# EAGLE design integrated_v2 (EAGLE 9.6.2)
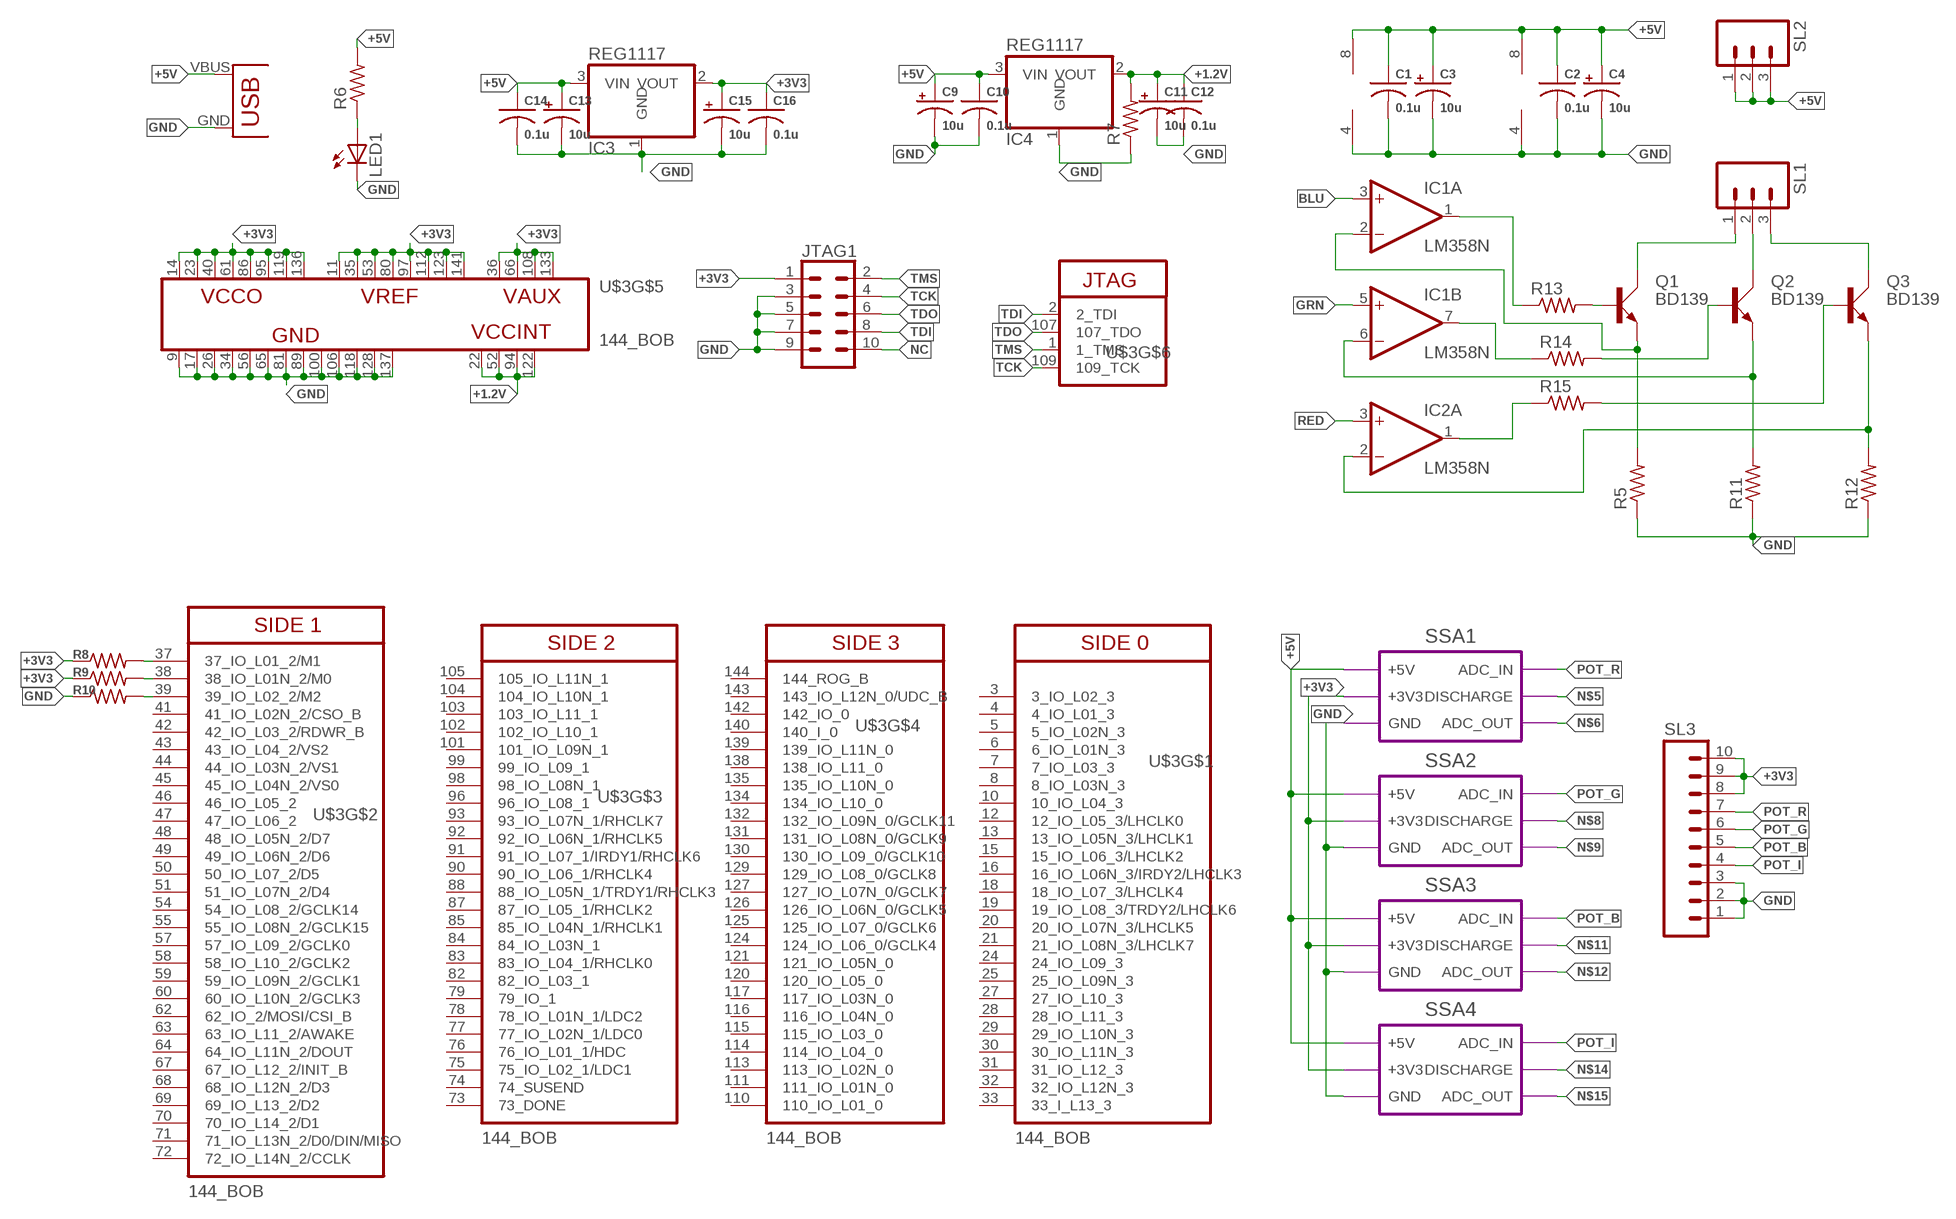
[diagram p0: schematic, sheet 1]

## Parts
C1  0.1u  CAP0603  [C0603]
C2  0.1u  CAP0603  [C0603]
C3  10u  CAP_POL_16V  [B/3528-21R]
C4  10u  CAP_POL_16V  [B/3528-21R]
C9  10u  CAP_POL_16V  [B/3528-21R]
C10  0.1u  CAP0603  [C0603]
C11  10u  CAP_POL_16V  [B/3528-21R]
C12  0.1u  CAP0603  [C0603]
C13  10u  CAP_POL_16V  [B/3528-21R]
C14  0.1u  CAP0603  [C0603]
C15  10u  CAP_POL_16V  [B/3528-21R]
C16  0.1u  CAP0603  [C0603]
IC1  LM358N  [DIL08]
IC2  LM358N  [DIL08]
IC3  REG1117  [SOT223]
IC4  REG1117  [SOT223]
JTAG1  CONN_05X2  [2X5-SHROUDED_LOCK_PROPER]
LED1  LED3MM  [LED3MM]
Q1  BD139  [TO126AV]
Q2  BD139  [TO126AV]
Q3  BD139  [TO126AV]
R5  4.7  R-US_0411/15  [0411/15]
R6  R-US_0204/7  [0204/7]
R7  R-US_0204/7  [0204/7]
R8  RESISTOR0805  [R0805]
R9  RESISTOR0805  [R0805]
R10  RESISTOR0805  [R0805]
R11  R-US_0411/15  [0411/15]
R12  R-US_0411/15  [0411/15]
R13  R-US_0204/7  [0204/7]
R14  R-US_0204/7  [0204/7]
R15  R-US_0204/7  [0204/7]
SL1  M03  [03P]
SL2  M03  [03P]
SL3  M10  [10P]
U$3  144_BOB  [144_BOB]
U$4  USB(POWER)  [USB(POWER)]

## Module instances
SSA1 = SINGLESLOPEADC
SSA2 = SINGLESLOPEADC
SSA3 = SINGLESLOPEADC
SSA4 = SINGLESLOPEADC

## Nets
+1.2V: C11.+ C12.1 IC4.2(VOUT) R7.2 U$3.22(22_VCCINT) U$3.52(52_VCCINT) U$3.94(94_VCCINT) U$3.122(122_VCCINT)
+3V3: C15.+ C16.1 IC3.2(VOUT) JTAG1.1 R8.1 R9.1 SL3.8 SL3.9 SL3.10 U$3.11(11_VREF) U$3.14(14_VCCO) U$3.23(23_VCCO) U$3.35(35_VREF) U$3.36(36_VAUX) U$3.40(40_VCCO) U$3.53(53_VREF) U$3.61(61_VCCO) U$3.66(66_VAUX) U$3.80(80_VREF) U$3.86(86_VCCO) U$3.95(95_VCCO) U$3.97(97_VREF) U$3.108(108_VAUX) U$3.112(112_VREF) U$3.119(119_VCCO) U$3.123(123_VREF) U$3.133(133_VAUX) U$3.136(136_VCCO) U$3.141(141_VREF) ; port SSA1.+3V3 SSA2.+3V3 SSA3.+3V3 SSA4.+3V3
+5V: C1.1 C2.1 C3.+ C4.+ C9.+ C10.1 C13.+ C14.1 IC1.8(P:V+) IC2.8(P:V+) IC3.3(VIN) IC4.3(VIN) R6.2 SL2.1 SL2.2 SL2.3 U$4.VBUS(VCC) ; port SSA1.+5V SSA2.+5V SSA3.+5V SSA4.+5V
BLU: IC1.3(A:+IN)
GND: C1.2 C2.2 C3.- C4.- C9.- C10.2 C11.- C12.2 C13.- C14.2 C15.- C16.2 IC1.4(P:V-) IC2.4(P:V-) IC3.1(GND) IC4.1(GND) JTAG1.3 JTAG1.5 JTAG1.7 JTAG1.9 LED1.K(C) R5.1 R7.1 R10.1 R11.1 R12.1 SL3.1 SL3.2 SL3.3 U$3.9(9_GND) U$3.17(17_GND) U$3.26(26_GND) U$3.34(34_GND) U$3.56(56_GND) U$3.65(65_GND) U$3.81(81_GND) U$3.89(89_GND) U$3.100(100_GND) U$3.106(106_GND) U$3.118(118_GND) U$3.128(128_GND) U$3.137(137_GND) U$4.GND ; port SSA1.GND SSA3.GND SSA4.GND SSA2.GND
GRN: IC1.5(B:+IN)
N$1: Q1.C SL1.1
N$2: Q3.C SL1.3
N$3: Q2.C SL1.2
N$5: port SSA1.DISCHARGE
N$6: port SSA1.ADC_OUT
N$8: port SSA2.DISCHARGE
N$9: port SSA2.ADC_OUT
N$11: port SSA3.DISCHARGE
N$12: port SSA3.ADC_OUT
N$14: port SSA4.DISCHARGE
N$15: port SSA4.ADC_OUT
N$16: Q1.B R13.2
N$17: Q2.B R14.2
N$18: Q3.B R15.2
N$19: IC1.6(B:-IN) Q2.E R11.2
N$20: IC1.1(A:OUT) R13.1
N$21: IC1.7(B:OUT) R14.1
N$22: IC2.1(A:OUT) R15.1
N$23: IC1.2(A:-IN) Q1.E R5.2
N$24: LED1.A R6.1
N$25: R8.2 U$3.37(37_IO_L01_2/M1)
N$26: R9.2 U$3.38(38_IO_L01N_2/M0)
N$27: R10.2 U$3.39(39_IO_L02_2/M2)
N$32: IC2.2(A:-IN) Q3.E R12.2
NC: JTAG1.10
POT_B: SL3.5 ; port SSA3.ADC_IN
POT_G: SL3.6 ; port SSA2.ADC_IN
POT_I: SL3.4 ; port SSA4.ADC_IN
POT_R: SL3.7 ; port SSA1.ADC_IN
RED: IC2.3(A:+IN)
TCK: JTAG1.4 U$3.109(109_TCK)
TDI: JTAG1.8 U$3.2(2_TDI)
TDO: JTAG1.6 U$3.107(107_TDO)
TMS: JTAG1.2 U$3.1(1_TMS)
Unconnected: IC2.5(B:+IN) IC2.6(B:-IN) IC2.7(B:OUT) U$3.3(3_IO_L02_3) U$3.4(4_IO_L01_3) U$3.5(5_IO_L02N_3) U$3.6(6_IO_L01N_3) U$3.7(7_IO_L03_3) U$3.8(8_IO_L03N_3) U$3.10(10_IO_L04_3) U$3.12(12_IO_L05_3/LHCLK0) U$3.13(13_IO_L05N_3/LHCLK1) U$3.15(15_IO_L06_3/LHCLK2) U$3.16(16_IO_L06N_3/IRDY2/LHCLK3) U$3.18(18_IO_L07_3/LHCLK4) U$3.19(19_IO_L08_3/TRDY2/LHCLK6) U$3.20(20_IO_L07N_3/LHCLK5) U$3.21(21_IO_L08N_3/LHCLK7) U$3.24(24_IO_L09_3) U$3.25(25_IO_L09N_3) U$3.27(27_IO_L10_3) U$3.28(28_IO_L11_3) U$3.29(29_IO_L10N_3) U$3.30(30_IO_L11N_3) U$3.31(31_IO_L12_3) U$3.32(32_IO_L12N_3) U$3.33(33_I_L13_3) U$3.41(41_IO_L02N_2/CSO_B) U$3.42(42_IO_L03_2/RDWR_B) U$3.43(43_IO_L04_2/VS2) U$3.44(44_IO_L03N_2/VS1) U$3.45(45_IO_L04N_2/VS0) U$3.46(46_IO_L05_2) U$3.47(47_IO_L06_2) U$3.48(48_IO_L05N_2/D7) U$3.49(49_IO_L06N_2/D6) U$3.50(50_IO_L07_2/D5) U$3.51(51_IO_L07N_2/D4) U$3.54(54_IO_L08_2/GCLK14) U$3.55(55_IO_L08N_2/GCLK15) U$3.57(57_IO_L09_2/GCLK0) U$3.58(58_IO_L10_2/GCLK2) U$3.59(59_IO_L09N_2/GCLK1) U$3.60(60_IO_L10N_2/GCLK3) U$3.62(62_IO_2/MOSI/CSI_B) U$3.63(63_IO_L11_2/AWAKE) U$3.64(64_IO_L11N_2/DOUT) U$3.67(67_IO_L12_2/INIT_B) U$3.68(68_IO_L12N_2/D3) U$3.69(69_IO_L13_2/D2) U$3.70(70_IO_L14_2/D1) U$3.71(71_IO_L13N_2/D0/DIN/MISO) U$3.72(72_IO_L14N_2/CCLK) U$3.73(73_DONE) U$3.74(74_SUSEND) U$3.75(75_IO_L02_1/LDC1) U$3.76(76_IO_L01_1/HDC) U$3.77(77_IO_L02N_1/LDC0) U$3.78(78_IO_L01N_1/LDC2) U$3.79(79_IO_1) U$3.82(82_IO_L03_1) U$3.83(83_IO_L04_1/RHCLK0) U$3.84(84_IO_L03N_1) U$3.85(85_IO_L04N_1/RHCLK1) U$3.87(87_IO_L05_1/RHCLK2) U$3.88(88_IO_L05N_1/TRDY1/RHCLK3) U$3.90(90_IO_L06_1/RHCLK4) U$3.91(91_IO_L07_1/IRDY1/RHCLK6) U$3.92(92_IO_L06N_1/RHCLK5) U$3.93(93_IO_L07N_1/RHCLK7) U$3.96(96_IO_L08_1) U$3.98(98_IO_L08N_1) U$3.99(99_IO_L09_1) U$3.101(101_IO_L09N_1) U$3.102(102_IO_L10_1) U$3.103(103_IO_L11_1) U$3.104(104_IO_L10N_1) U$3.105(105_IO_L11N_1) U$3.110(110_IO_L01_0) U$3.111(111_IO_L01N_0) U$3.113(113_IO_L02N_0) U$3.114(114_IO_L04_0) U$3.115(115_IO_L03_0) U$3.116(116_IO_L04N_0) U$3.117(117_IO_L03N_0) U$3.120(120_IO_L05_0) U$3.121(121_IO_L05N_0) U$3.124(124_IO_L06_0/GCLK4) U$3.125(125_IO_L07_0/GCLK6) U$3.126(126_IO_L06N_0/GCLK5) U$3.127(127_IO_L07N_0/GCLK7) U$3.129(129_IO_L08_0/GCLK8) U$3.130(130_IO_L09_0/GCLK10) U$3.131(131_IO_L08N_0/GCLK9) U$3.132(132_IO_L09N_0/GCLK11) U$3.134(134_IO_L10_0) U$3.135(135_IO_L10N_0) U$3.138(138_IO_L11_0) U$3.139(139_IO_L11N_0) U$3.140(140_I_0) U$3.142(142_IO_0) U$3.143(143_IO_L12N_0/UDC_B) U$3.144(144_ROG_B)

## Library data of the parts
C1 C2 C10 C12 C14 C16 = CEDT_JANUARY_2015_v5:CAP
C3 C4 C9 C11 C13 C15 = CEDT_JANUARY_2015_v5:CAP_POL
IC1 IC2 = CEDT_JANUARY_2015:LM358: OP AMP also LM158; LM258; LM2904 Source: http://cache.national.com/ds/LM/LM158.pdf
IC3 IC4 = CEDT_JANUARY_2015_v5:REG1117: 800mA and 1A Low Dropout (LDO) Positive Regulator 1.8V, 2.5V, 2.85V, 3.3V, 5V, and Adj
JTAG1 = SparkFun-Connectors_v3:CONN_05X2: Multi connection point. Often used as Generic Header-pin footprint for 0.1 inch spaced/style header connections For AVR SPI programming port, see special device with nice symbol: "AVR_SPI_PROG_5x2.dev" You can populate with any combo of single row headers, but if you'd like an exact match, check these: 2x5 AVR ICSP Male Header <https://www.sparkfun.com/products/778> (PRT-00778) 2x5 Pin Shrouded Header <https://www.sparkfun.com/products/8506> (PRT-08506) On any of the 0.1 inch spaced packages, you can populate with these: Break Away Headers - Straight <https://www.sparkfun.com/products/116> (PRT-00116) Break Away Male Headers - Right Angle <https://www.sparkfun.com/products/553> (PRT-00553) Female Headers <https://www.sparkfun.com/products/115> (PRT-00115) Break Away Headers - Machine Pin <https://www.sparkfun.com/products/117> (PRT-00117) Break Away Female Headers - Swiss Machine Pin <https://www.sparkfun.com/products/743> (PRT-00743) Special note: the shrouded connector mates well with our 5x2 ribbon cables: 2x5 Pin IDC Ribbon Cable <https://www.sparkfun.com/products/8535> (PRT-08535)
LED1 = CEDT_JANUARY_2015_v5:LED
Q1-Q3 = transistor-power:BD139: NPN TRANSISTOR
R5 R11-R15 = resistor:R-US_: RESISTOR, American symbol
R6 R7 = rcl:R-US_: RESISTOR, American symbol; SPICEPREFIX: R
R8-R10 = CEDT_JANUARY_2015_v5:RESISTOR
SL1 SL2 = con-amp-quick:M03: AMP QUICK CONNECTOR; OC_FARNELL: unknown; OC_NEWARK: unknown
SL3 = con-amp-quick:M10: AMP QUICK CONNECTOR; OC_FARNELL: unknown; OC_NEWARK: unknown
U$3 = Suprio_Lib:144_BOB
U$4 = CEDT_JANUARY_2015_v5:USB(POWER)

## Module SINGLESLOPEADC
Ports: +5V(pwr) +3V3(pwr) GND(pwr) ADC_IN(in) DISCHARGE(in) ADC_OUT(out)
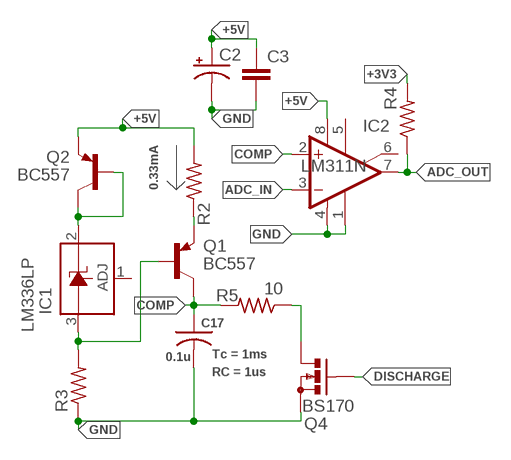
[diagram p1: schematic, module SINGLESLOPEADC, sheet 1]

### Parts
C2  CPOL-USE2.5-5  [E2,5-5]
C3  C-EU025-024X044  [C025-024X044]
C17  0.1u  CAP0603  [C0603]
IC1  LM336LP  [TO92]
IC2  LM311N  [DIL08]
Q1  BC557  PNP_BC557*TO92  [TO92]
Q2  BC557  PNP_BC557*TO92  [TO92]
Q4  BS170  [SOT54E]
R2  R-US_0204/7  [0204/7]
R3  R-US_0204/7  [0204/7]
R4  R-US_0204/7  [0204/7]
R5  10  RESISTOR0207/7  [0207/7]

### Nets
+3V3: R4.2
+5V: C2.+ C3.1 IC2.8(V+) Q2.3(E) R2.2
ADC_IN: IC2.3(-IN)
ADC_OUT: IC2.7(OUT) R4.1
COMP: C17.1 IC2.2(+IN) Q1.1(C) R5.2
DISCHARGE: Q4.G
GND: C2.- C3.2 C17.2 IC2.1(GND) IC2.4(V-) Q4.S R3.1
N$2: Q1.3(E) R2.1
N$3: IC1.2(C) Q2.1(C) Q2.2(B)
N$4: IC1.3(A) Q1.2(B) R3.2
N$5: Q4.D R5.1
Unconnected: IC1.1(ADJ) IC2.5(ON) IC2.6(ON/STR)

### Notes on the sheet
- 0.33mA
- Tc = 1ms
- RC = 1us

### Library data of the parts
C2 = rcl:CPOL-US: POLARIZED CAPACITOR, American symbol; SPICEPREFIX: C
C3 = rcl:C-EU: CAPACITOR, European symbol; SPICEPREFIX: C
C17 = CEDT_JANUARY_2015_v5:CAP
IC1 = linear:LM336: 2.5-V INTEGRATED REFERENCE CIRCUITS LM236 Source: http://focus.ti.com/lit/ds/symlink/lm336-2.5.pdf
IC2 = linear:LM311: COMPARATOR
Q1 Q2 = Transistor:PNP_: PNP - Popular parts; CATEGORY: Transistor; SUB-CATEGORY: BJT; TYPE: PNP
Q4 = transistor-small-signal:BS170: N-CHANNEL MOS FET
R2-R4 = rcl:R-US_: RESISTOR, American symbol; SPICEPREFIX: R
R5 = CEDT_JANUARY_2015_v5 (1):RESISTOR

## Net classes
0 default: width 0.406 mm

## Board
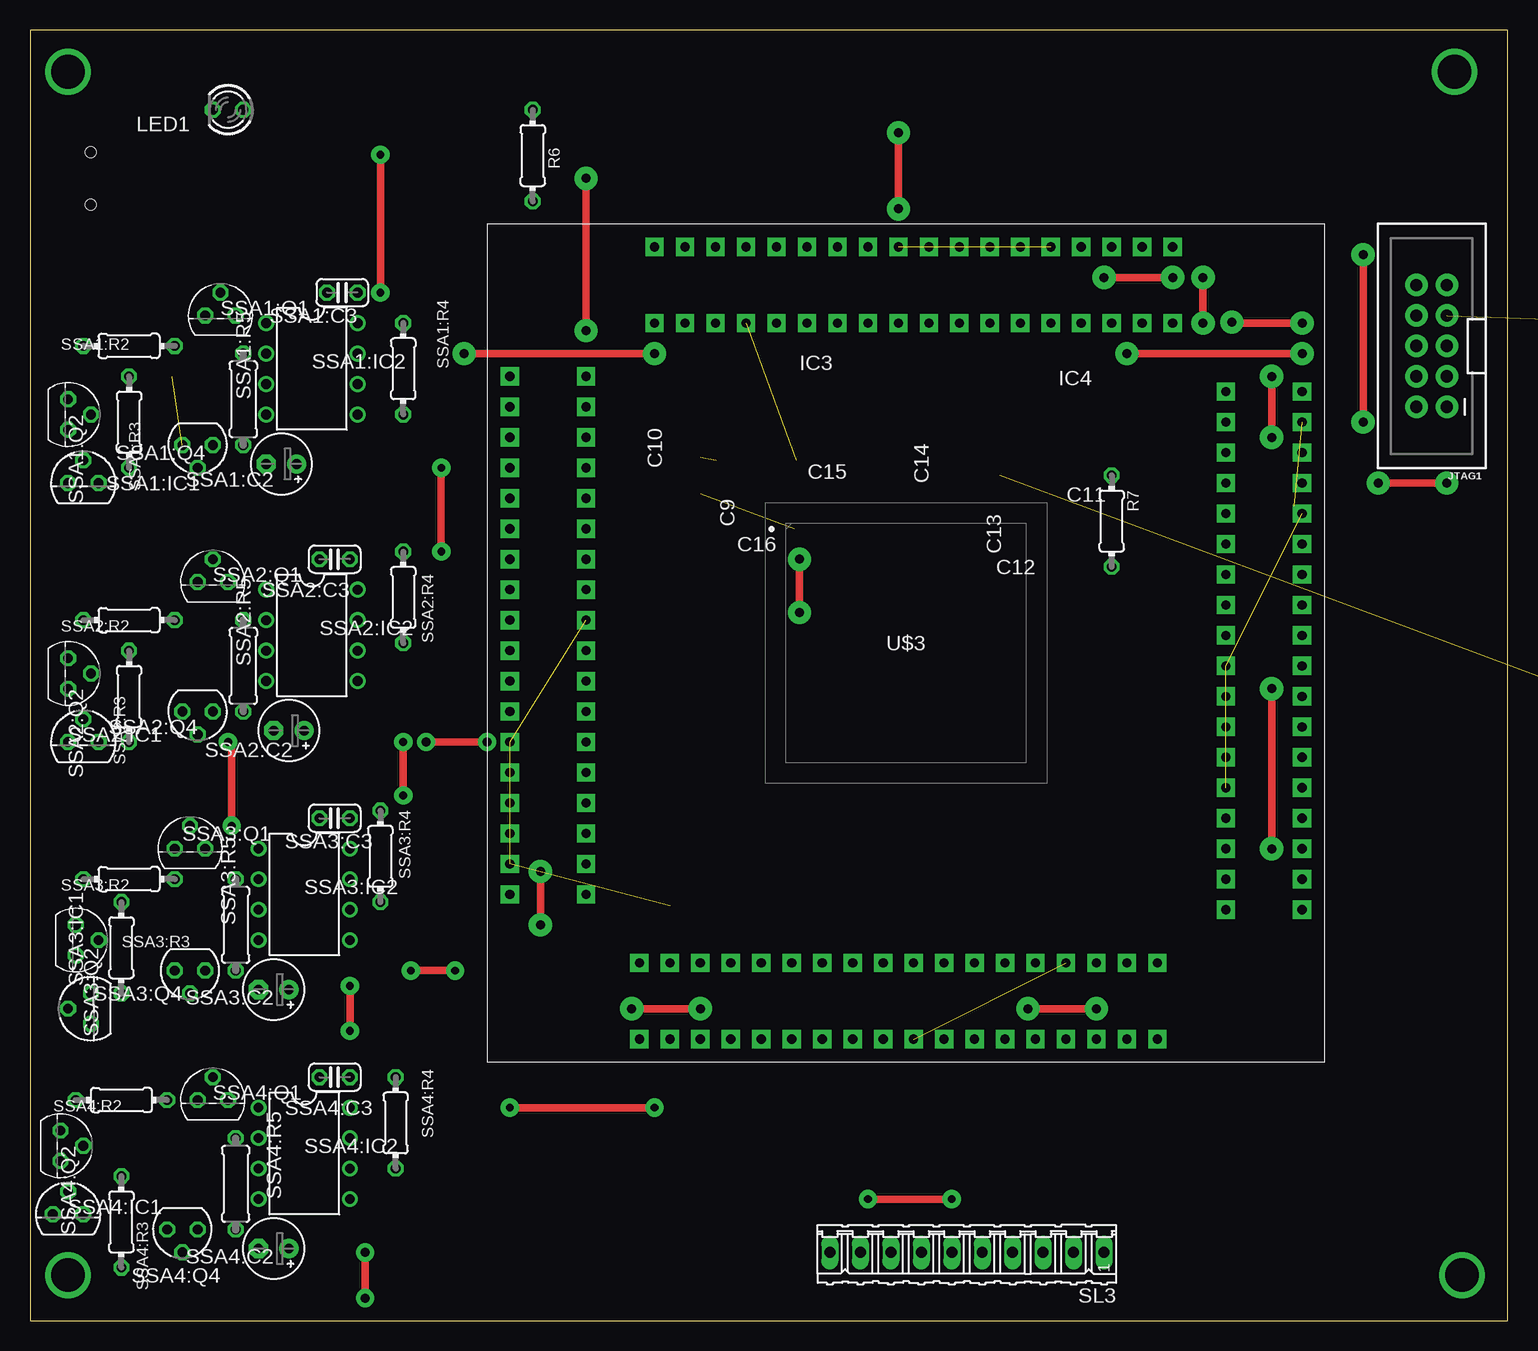
[diagram p2: board, top side]
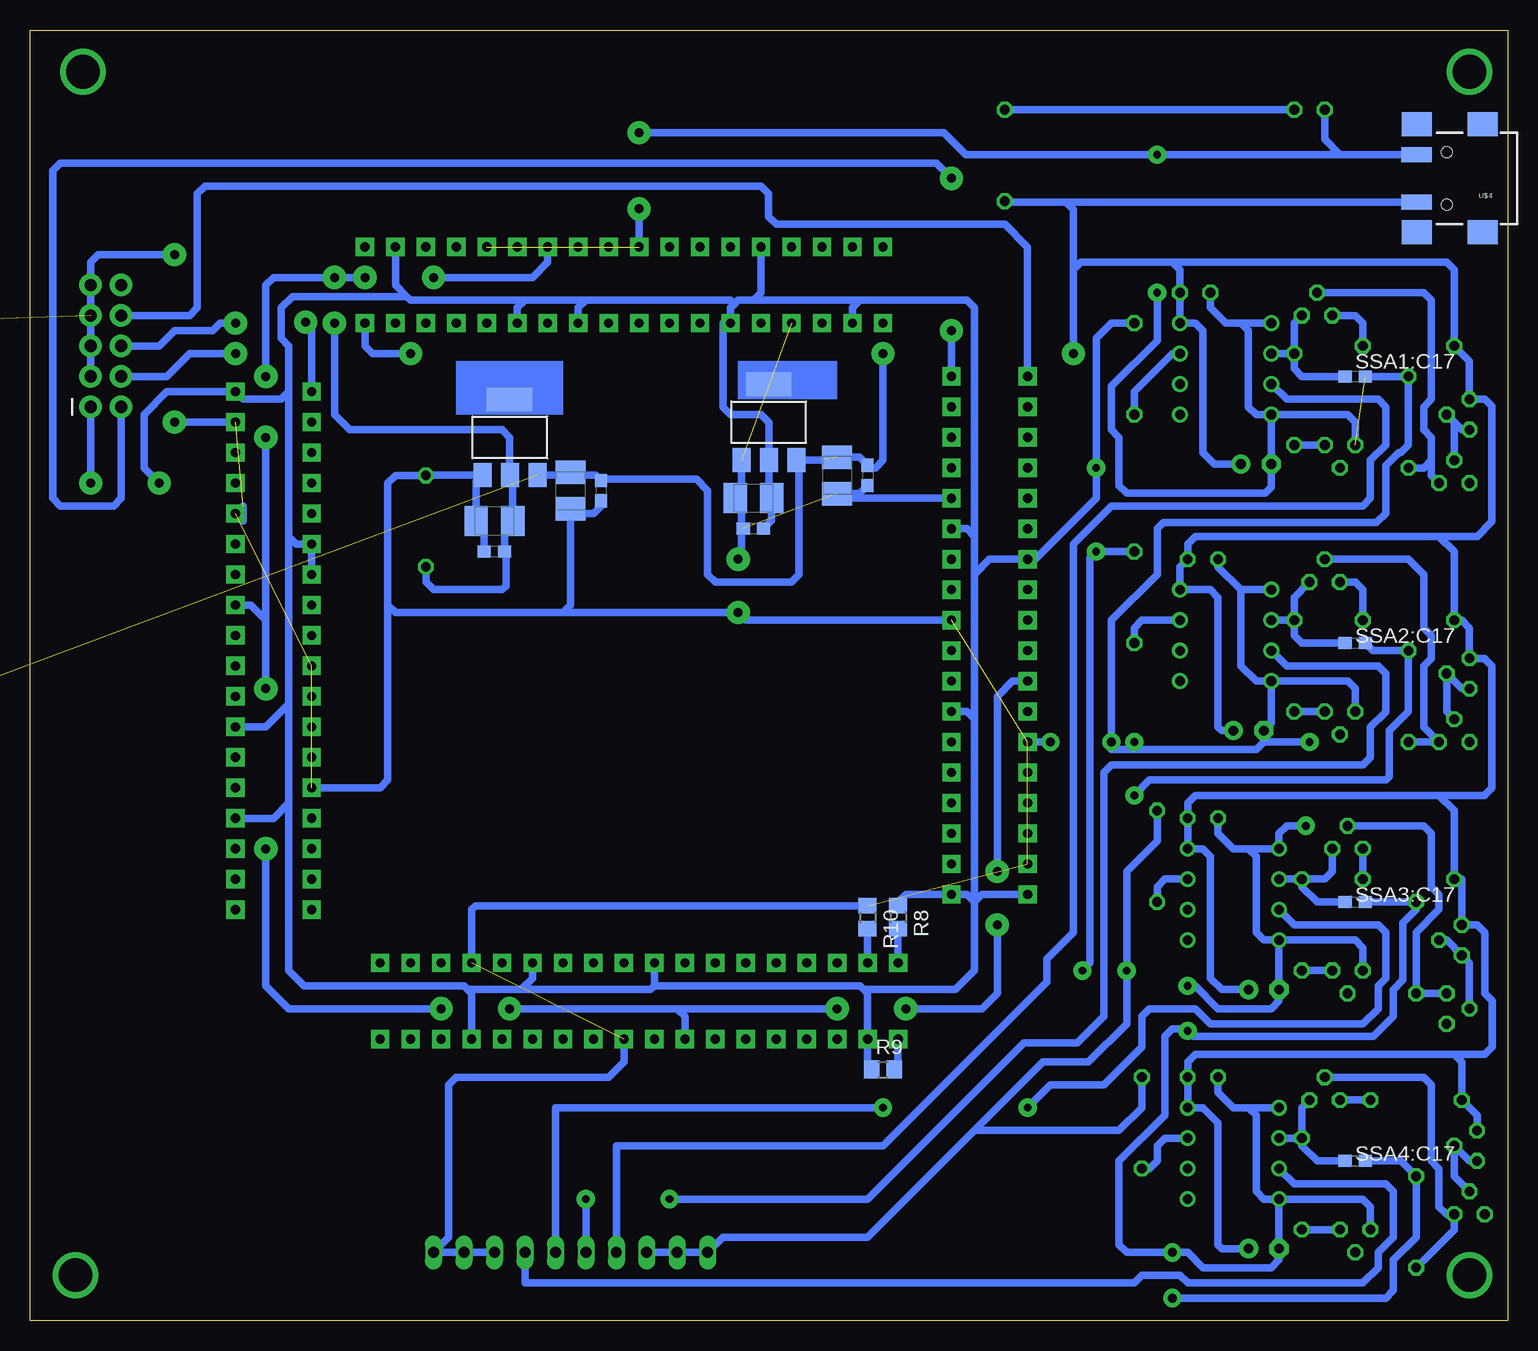
[diagram p3: board, bottom side, seen from below]

Size 123.17 x 107.62 mm. Coordinates in mm from the lower left corner, seen from the top.
Outline: 0,0 123.17,0 123.17,107.62 0,107.62 0,0
Copper layers (1*16): Top 0.035mm / dielectric 1.5mm / Bottom 0.035mm
Design rules "default *": minimum track width 6mil, minimum drill 0.35mm, track to track 16mil, track to pad 16mil, pad to pad 16mil, via to via 16mil, smd to smd 16mil, copper to edge 40mil, drill to drill 6mil, minimum pad ring 10mil, minimum via ring 8mil, stop-mask expansion 4mil, vias tented up to drill 0mil, thermal gap 10mil

### Footprints (pad centres in the part's own frame; a part is rotated, then mirrored left to right if it is on the bottom)
C0603 = smd 1.1 x 1: 1 -0.85,0; 2 0.85,0
B/3528-21R = smd 1.95 x 2.5: + 1.525,0; - -1.525,0
DIL08 = drill 0.813 long: 1 -3.81,-3.81; 2 -1.27,-3.81; 3 1.27,-3.81; 4 3.81,-3.81; 5 3.81,3.81; 6 1.27,3.81; 7 -1.27,3.81; 8 -3.81,3.81
SOT223 = smd 1.499 x 2.007: 1 -2.261,-3.15; 2 0.025,-3.15; 3 2.311,-3.15 | smd 3.81 x 2.007: 4 0,3.15
2X5-SHROUDED_LOCK_PROPER = drill 1.016 pad 1.88: 1 -1.27,5.08; 2 1.27,5.08; 3 -1.27,2.54; 4 1.27,2.54; 5 -1.27,0; 6 1.27,0; 7 -1.27,-2.54; 8 1.27,-2.54; 9 -1.27,-5.08; 10 1.27,-5.08
LED3MM = drill 0.813 octagon: A -1.27,0; K 1.27,0
TO126AV = drill 1.016 long: B 2.286,-1.27; C 0,-1.27; E -2.286,-1.27
0411/15 = drill 0.914 octagon: 1 -7.62,0; 2 7.62,0
0204/7 = drill 0.813 octagon: 1 -3.81,0; 2 3.81,0
R0805 = smd 1.3 x 1.5: 1 -0.95,0; 2 0.95,0
03P = drill 0.914 long: 1 -2.54,0; 2 0,0; 3 2.54,0
10P = drill 0.914 long: 1 -11.43,0; 2 -8.89,0; 3 -6.35,0; 4 -3.81,0; 5 -1.27,0; 6 1.27,0; 7 3.81,0; 8 6.35,0; 9 8.89,0; 10 11.43,0
E2,5-5 = drill 0.813 pad 1.6: + -1.27,0 | drill 0.813 pad 1.6 octagon: - 1.27,0
C025-024X044 = drill 0.813 octagon: 1 -1.27,0; 2 1.27,0
TO92 = drill 0.813 octagon: 1 -1.27,0; 2 0,1.905; 3 1.27,0
DIL08' = drill 0.813 pad 1.27: 1 -3.81,-3.81; 2 -1.27,-3.81; 3 1.27,-3.81; 4 3.81,-3.81; 5 3.81,3.81; 6 1.27,3.81; 7 -1.27,3.81; 8 -3.81,3.81
TO92' = drill 0.813 octagon: 1 1.27,0; 2 0,1.905; 3 -1.27,0
SOT54E = drill 0.813 octagon: D -1.27,0; G 0,1.905; S 1.27,0
0207/7 = drill 0.813 octagon: 1 -3.81,0; 2 3.81,0
144_BOB = drill 0.762 pad 1.524 square: 1 -26.67,21.59; 2 -33.02,21.59; 3 -26.67,19.05; 4 -33.02,19.05; 5 -26.67,16.51; 6 -33.02,16.51; 7 -26.67,13.97; 8 -33.02,13.97; 9 -26.67,11.43; 10 -33.02,11.43; 11 -26.67,8.89; 12 -33.02,8.89; 13 -26.67,6.35; 14 -33.02,6.35; 15 -26.67,3.81; 16 -33.02,3.81; 17 -26.67,1.27; 18 -33.02,1.27; 19 -26.67,-1.27; 20 -33.02,-1.27; 21 -26.67,-3.81; 22 -33.02,-3.81; 23 -26.67,-6.35; 24 -33.02,-6.35; 25 -26.67,-8.89; 26 -33.02,-8.89; 27 -26.67,-11.43; 28 -33.02,-11.43; 29 -26.67,-13.97; 30 -33.02,-13.97; 31 -26.67,-16.51; 32 -33.02,-16.51; 33 -26.67,-19.05; 34 -33.02,-19.05; 35 -26.67,-21.59; 36 -33.02,-21.59; 37 -22.225,-27.305; 38 -22.225,-33.655; 39 -19.685,-27.305; 40 -19.685,-33.655; 41 -17.145,-27.305; 42 -17.145,-33.655; 43 -14.605,-27.305; 44 -14.605,-33.655; 45 -12.065,-27.305; 46 -12.065,-33.655; 47 -9.525,-27.305; 48 -9.525,-33.655; 49 -6.985,-27.305; 50 -6.985,-33.655; 51 -4.445,-27.305; 52 -4.445,-33.655; 53 -1.905,-27.305; 54 -1.905,-33.655; 55 0.635,-27.305; 56 0.635,-33.655; 57 3.175,-27.305; 58 3.175,-33.655; 59 5.715,-27.305; 60 5.715,-33.655; 61 8.255,-27.305; 62 8.255,-33.655; 63 10.795,-27.305; 64 10.795,-33.655; 65 13.335,-27.305; 66 13.335,-33.655; 67 15.875,-27.305; 68 15.875,-33.655; 69 18.415,-27.305; 70 18.415,-33.655; 71 20.955,-27.305; 72 20.955,-33.655; 73 26.67,-22.86; 74 33.02,-22.86; 75 26.67,-20.32; 76 33.02,-20.32; 77 26.67,-17.78; 78 33.02,-17.78; 79 26.67,-15.24; 80 33.02,-15.24; 81 26.67,-12.7; 82 33.02,-12.7; 83 26.67,-10.16; 84 33.02,-10.16; 85 26.67,-7.62; 86 33.02,-7.62; 87 26.67,-5.08; 88 33.02,-5.08; 89 26.67,-2.54; 90 33.02,-2.54; 91 26.67,0; 92 33.02,0; 93 26.67,2.54; 94 33.02,2.54; 95 26.67,5.08; 96 33.02,5.08; 97 26.67,7.62; 98 33.02,7.62; 99 26.67,10.16; 100 33.02,10.16; 101 26.67,12.7; 102 33.02,12.7; 103 26.67,15.24; 104 33.02,15.24; 105 26.67,17.78; 106 33.02,17.78; 107 26.67,20.32; 108 33.02,20.32; 109 22.225,26.035; 110 22.225,32.385; 111 19.685,26.035; 112 19.685,32.385; 113 17.145,26.035; 114 17.145,32.385; 115 14.605,26.035; 116 14.605,32.385; 117 12.065,26.035; 118 12.065,32.385; 119 9.525,26.035; 120 9.525,32.385; 121 6.985,26.035; 122 6.985,32.385; 123 4.445,26.035; 124 4.445,32.385; 125 1.905,26.035; 126 1.905,32.385; 127 -0.635,26.035; 128 -0.635,32.385; 129 -3.175,26.035; 130 -3.175,32.385; 131 -5.715,26.035; 132 -5.715,32.385; 133 -8.255,26.035; 134 -8.255,32.385; 135 -10.795,26.035; 136 -10.795,32.385; 137 -13.335,26.035; 138 -13.335,32.385; 139 -15.875,26.035; 140 -15.875,32.385; 141 -18.415,26.035; 142 -18.415,32.385; 143 -20.955,26.035; 144 -20.955,32.385
USB(POWER) = smd 2.54 x 1.27: GND 2.5,-1.981; VBUS 2.5,1.981 | smd 2.5 x 2: GND@1 -3,-4.5; GND@2 -3,4.5; GND@3 2.5,4.5; GND@4 2.5,-4.5 | hole 0.9: 0,2.2; 0,-2.2

### Placement (x,y rotation side)
C1  158.75,51.44 0 bottom  (outside the outline)
C2  158.75,46.35 0 bottom  (outside the outline)
C3  159.38,40.01 0 bottom  (outside the outline)
C4  159.38,33.02 0 bottom  (outside the outline)
C9  55.88,70.48 90 bottom
C10  53.34,70.48 270 bottom
C11  84.45,66.67 0 bottom
C12  84.45,64.14 180 bottom
C13  78.11,69.22 90 bottom
C14  75.56,69.22 270 bottom
C15  62.87,68.58 0 bottom
C16  62.87,66.04 180 bottom
IC1  142.88,100.97 0 top  (outside the outline)
IC2  155.57,100.97 0 top  (outside the outline)
IC3  61.59,74.93 0 bottom
IC4  83.19,73.66 0 bottom
JTAG1  116.84,81.28 180 top
LED1  16.51,100.97 180 top
Q1  140.34,94.61 0 top  (outside the outline)
Q2  149.22,94.61 0 top  (outside the outline)
Q3  158.12,94.61 0 top  (outside the outline)
R5  144.15,83.19 0 top  (outside the outline)
R6  41.91,97.16 270 top
R7  90.17,66.67 270 top
R8  50.8,33.66 270 bottom
R9  52.07,20.95 0 bottom
R10  53.34,33.66 270 bottom
R11  144.15,76.83 0 top  (outside the outline)
R12  144.15,70.48 0 top  (outside the outline)
R13  157.48,71.75 0 top  (outside the outline)
R14  140.34,65.41 0 top  (outside the outline)
R15  149.86,65.41 0 top  (outside the outline)
SL1  147.96,49.53 0 top  (outside the outline)
SL2  139.7,49.53 0 top  (outside the outline)
SL3  78.11,5.71 180 top
SSA1:C2  [E2,5-5]  20.95,71.44 180 top
SSA1:C3  [C025-024X044]  26.04,85.72 180 top
SSA1:C17  0.1u  [C0603]  12.7,78.74 0 bottom
SSA1:IC1  LM336LP  [TO92]  4.45,69.85 0 top
SSA1:IC2  LM311N  [DIL08']  23.5,79.38 270 top
SSA1:Q1  BC557  [TO92']  15.88,83.82 0 top
SSA1:Q2  BC557  [TO92']  3.17,75.56 270 top
SSA1:Q4  BS170  [SOT54E]  13.97,73.03 180 top
SSA1:R2  [0204/7]  8.26,81.28 180 top
SSA1:R3  [0204/7]  8.26,74.93 270 top
SSA1:R4  [0204/7]  31.11,79.38 90 top
SSA1:R5  10  [0207/7]  17.78,76.83 90 top
SSA2:C2  [E2,5-5]  21.59,49.21 180 top
SSA2:C3  [C025-024X044]  25.4,63.5 180 top
SSA2:C17  0.1u  [C0603]  12.7,56.52 0 bottom
SSA2:IC1  LM336LP  [TO92]  4.45,48.26 0 top
SSA2:IC2  LM311N  [DIL08']  23.5,57.15 270 top
SSA2:Q1  BC557  [TO92']  15.24,61.59 0 top
SSA2:Q2  BC557  [TO92']  3.17,53.98 270 top
SSA2:Q4  BS170  [SOT54E]  13.97,50.8 180 top
SSA2:R2  [0204/7]  8.26,58.42 180 top
SSA2:R3  [0204/7]  8.26,52.07 270 top
SSA2:R4  [0204/7]  31.11,60.33 90 top
SSA2:R5  10  [0207/7]  17.78,54.61 90 top
SSA3:C2  [E2,5-5]  20.32,27.62 180 top
SSA3:C3  [C025-024X044]  25.4,41.91 180 top
SSA3:C17  0.1u  [C0603]  12.7,34.92 0 bottom
SSA3:IC1  LM336LP  [TO92]  5.08,26.04 90 top
SSA3:IC2  LM311N  [DIL08']  22.86,35.56 270 top
SSA3:Q1  BC557  [TO92']  13.34,39.37 0 top
SSA3:Q2  BC557  [TO92']  3.81,31.75 270 top
SSA3:Q4  BS170  [SOT54E]  13.34,29.21 180 top
SSA3:R2  [0204/7]  8.26,36.83 180 top
SSA3:R3  [0204/7]  7.62,31.11 270 top
SSA3:R4  [0204/7]  29.21,38.73 90 top
SSA3:R5  10  [0207/7]  17.14,33.02 90 top
SSA4:C2  [E2,5-5]  20.32,6.03 180 top
SSA4:C3  [C025-024X044]  25.4,20.32 180 top
SSA4:C17  0.1u  [C0603]  12.7,13.34 0 bottom
SSA4:IC1  LM336LP  [TO92]  3.17,8.89 0 top
SSA4:IC2  LM311N  [DIL08']  22.86,13.97 270 top
SSA4:Q1  BC557  [TO92']  15.24,18.41 0 top
SSA4:Q2  BC557  [TO92']  2.54,14.61 270 top
SSA4:Q4  BS170  [SOT54E]  12.7,7.62 180 top
SSA4:R2  [0204/7]  7.62,18.41 180 top
SSA4:R3  [0204/7]  7.62,8.26 270 top
SSA4:R4  [0204/7]  30.48,16.51 90 top
SSA4:R5  10  [0207/7]  17.14,11.43 90 top
U$3  73.03,57.15 0 top
U$4  5.08,95.25 180 bottom

### Tracks (layer width: path | path; a pad name or v marks a point on that pad's centre or on a via)
+1.2V  (via drill 0.75 pad 1.93)
  Top 0.61: v103.5,39.37 v103.5,52.7 | v103.5,73.66 v103.5,78.74 | v95.25,87 v89.53,87 | v83.19,26.04 v88.9,26.04 | v55.88,26.04 v50.16,26.04 | v42.55,33.02 v42.55,37.47 | v97.79,87 v97.79,83.19
  Bottom 0.61: v103.5,52.7 103.5,58.42 | 103.5,58.42 v103.5,73.66 | v103.5,78.74 103.5,86.36 102.87,87 v97.79,87 v95.25,87 | v89.53,87 81.28,87 80.01,88.27 U$3.122 | U$3.52 68.58,25.4 69.22,26.04 | 69.22,26.04 v83.19,26.04 | v88.9,26.04 101.6,26.04 103.5,27.94 v103.5,39.37 | 69.22,26.04 v55.88,26.04 | v50.16,26.04 43.81,26.04 42.55,27.3 v42.55,33.02 | v42.55,37.47 42.55,52.07 41.27,53.34 U$3.22 | IC4.2 83.19,70.48 | IC4.2 83.19,70.54 83.19,73.66 83.82,74.3 96.52,74.3 97.79,75.56 v97.79,83.19 | R7.2 90.17,61.59 89.53,60.96 83.82,60.96 83.5,61.28 83.5,64.03 C12.1 83.61,66 C11.+ 82.93,70.28 IC4.2 | U$3.94 104.78,59.69 103.5,58.42
+3V3  (via drill 0.65 pad 1.52, 0.75 pad 1.93)
  Top 0.61: v118.11,69.85 v112.39,69.85 | v31.75,29.21 v35.43,29.21 | v34.29,71.12 v34.29,64.14
  Bottom 0.61: 62.87,85.09 62.23,85.72 U$3.136 | 62.87,85.09 64.14,85.09 64.45,84.77 | 64.45,84.77 64.77,84.45 64.77,83.82 | 64.77,83.82 U$3.133 | 64.45,84.77 64.77,85.09 76.83,85.09 | 76.83,85.09 77.47,84.45 U$3.123 | 76.83,85.09 81.92,85.09 | 81.92,85.09 82.55,84.45 U$3.119 | 81.92,85.09 91.44,85.09 91.76,85.41 | 91.76,85.41 92.71,86.36 U$3.112 | 91.76,85.41 101.28,85.41 102.23,84.45 102.23,81.92 101.6,81.28 101.6,77.47 | 101.6,77.47 102.23,76.83 105.41,76.83 U$3.108 111.76,77.47 113.67,75.56 113.67,71.12 v112.39,69.85 | 101.6,77.47 101.6,65.41 | 101.6,65.41 100.97,64.77 U$3.97 U$3.95 | 101.6,65.41 101.6,51.44 | 101.6,51.44 103.5,49.53 U$3.86 | 101.6,51.44 101.6,43.18 | 101.6,43.18 102.87,41.91 U$3.80 | 101.6,43.18 101.6,29.21 100.33,27.94 87,27.94 86.68,27.62 | 86.68,27.62 86.36,27.3 U$3.66 | 86.68,27.62 82.23,27.62 | U$3.61 81.28,28.57 82.23,27.62 | 82.23,27.62 71.44,27.62 71.12,27.94 | U$3.53 71.12,27.94 | 53.66,27.62 53.98,27.94 71.12,27.94 | 53.66,27.62 53.34,27.3 U$3.40 53.34,21.27 R9.1 | 53.66,27.62 46.04,27.62 44.45,29.21 44.45,34.92 | 44.45,34.92 45.09,35.56 U$3.35 50.16,35.56 50.8,34.92 R8.1 | 44.45,34.92 43.81,35.56 U$3.36 | 44.45,34.92 44.45,50.16 | U$3.23 45.09,50.8 44.45,50.16 | 44.45,50.16 44.45,62.23 | 44.45,62.23 43.18,63.5 U$3.14 39.37,63.5 34.29,68.58 v34.29,71.12 34.29,81.92 33.02,83.19 SSA1:R4.2 | 44.45,62.23 44.45,65.41 | 44.45,65.41 45.09,66.04 U$3.11 | 53.98,85.09 45.09,85.09 44.45,84.45 44.45,65.41 | 53.98,85.09 54.61,84.45 U$3.141 | 53.98,85.09 62.87,85.09 | IC3.2 61.59,71.75 | IC3.2 61.57,74.91 62.23,75.56 64.77,75.56 65.41,76.2 65.41,83.19 64.77,83.82 | IC3.2 61.57,68.81 C15.+ 61.34,66.72 C16.1
  Bottom 0.61: JTAG1.1 v118.11,69.85 | SSA3:R4.2 29.21,40.01 31.75,37.47 v31.75,29.21 | v35.43,29.21 34.8,29.84 34.8,63.63 v34.29,64.14 SSA2:R4.2 | SL3.10 SL3.9 SL3.8 | SL3.10 65.41,6.99 53.34,6.99 44.45,15.88 | 66.67,5.08 SL3.10 | SSA4:R4.2 30.48,17.78 32.38,15.88 44.45,15.88 | v31.75,29.21 31.75,31.11 | 44.45,15.88 38.73,21.59 34.92,21.59 31.75,24.77 v31.75,29.21
+5V  (via drill 0.75 pad 1.93)  (10 unrouted)
  Top 0.61: v52.07,80.64 v36.2,80.64
  Bottom 0.61: 57.17,71.78 59.05,71.78 | 59.05,71.78 IC3.3 | 59.05,71.78 59.05,62.23 59.69,61.59 66.04,61.59 66.67,62.23 66.67,69.22 67.63,70.17 75.46,70.17 C14.1 76.01,70.51 77.88,70.51 | U$4.VBUS 36.83,93.27 | 36.83,93.27 41.83,93.27 R6.2 | C9.+ 54.02,72.01 C10.1 53.12,71.12 52.7,71.12 52.07,71.75 v52.07,80.64 | 77.88,70.51 IC4.3 | C13.+ 77.88,70.51 | 5.71,65.41 26.04,65.41 26.67,64.77 SSA2:C3.1 27.3,62.87 SSA2:IC2.8 24.77,60.96 24.13,60.33 24.13,49.53 23.81,49.21 SSA2:C2.+ | 5.71,65.41 4.45,64.14 SSA2:R2.2 3.81,58.42 3.17,57.78 SSA2:Q2.3 1.91,55.24 1.91,55.19 1.32,54.61 1.32,44.45 1.91,43.87 1.91,43.81 5.71,43.81 | 5.71,43.81 26.04,43.81 26.67,43.18 SSA3:C3.1 SSA3:IC2.8 25.4,39.37 24.77,38.73 24.77,28.57 23.81,27.62 SSA3:C2.+ | 5.71,43.81 4.45,42.55 SSA3:R2.2 3.81,36.83 SSA3:Q2.3 2.54,33.02 1.91,32.38 1.91,27.3 1.27,26.67 1.27,22.86 1.91,22.23 4.45,22.23 | 4.45,22.23 26.04,22.23 26.67,21.59 SSA4:C3.1 SSA4:IC2.8 25.4,17.78 24.13,16.51 24.13,6.35 23.81,6.03 SSA4:C2.+ | SSA1:C2.+ 24.45,71.44 25.4,72.39 25.4,82.55 26.04,83.19 SSA1:IC2.8 SSA1:C3.1 27.3,87.63 27.94,88.27 | 36.2,87.63 v36.2,80.64 | SSA4:Q2.3 2.54,17.14 SSA4:R2.2 3.81,21.59 4.45,22.23 | 27.94,88.27 35.56,88.27 36.2,87.63 | 27.94,88.27 5.08,88.27 4.45,87.63 SSA1:R2.2 3.17,80.01 SSA1:Q2.3 1.91,76.83 1.32,76.25 1.32,66.62 2.54,65.41 5.71,65.41 | 36.83,93.27 36.2,92.63 36.2,87.63
GND  (via drill 0.65 pad 1.52, 0.75 pad 1.52, 0.75 pad 1.93)  (20 unrouted)
  Top 0.61: v64.14,63.5 v64.14,59.05 | v72.39,99.06 v72.39,92.71 | v111.12,88.9 v111.12,74.93 | v27.94,1.91 v27.94,5.71 | v26.67,27.94 v26.67,24.18 | v16.51,48.26 16.82,47.95 v16.82,41.27 | v29.21,85.72 v29.21,97.23 | v31.11,43.81 v31.11,48.26 | v33.02,48.26 v38.1,48.26
  Bottom 0.61: 64.14,71.5 IC3.1 63.86,67.94 | U$3.17 63.5,58.42 v64.14,59.05 78.74,59.05 | U$4.GND 13.97,97.23 | 13.97,97.23 v29.21,97.23 45.16,97.23 46.99,99.06 v72.39,99.06 | v72.39,92.71 U$3.128 | IC4.1 85.72,70.23 | IC4.1 90.14,70.51 R7.1 92.71,70.48 93.34,69.85 93.34,59.69 | 78.74,59.05 92.71,59.05 93.34,59.69 | 93.34,59.69 93.34,45.09 93.98,44.45 U$3.81 | C10.2 54.02,68.96 C9.- 55.88,68.58 U$3.9 | C14.2 75.56,67.94 76.2,67.31 77.72,67.31 C13.- 78.11,59.69 78.74,59.05 | C11.- 85.98,67.31 | 85.98,67.31 85.98,69.98 IC4.1 | C12.2 85.31,66.64 85.98,67.31 | 63.86,67.94 63.86,66.18 | 63.86,66.18 63.86,63.78 v64.14,63.5 | C16.2 63.86,66.18 | C15.- 64.39,68.48 63.86,67.94 | JTAG1.3 JTAG1.5 JTAG1.7 JTAG1.9 118.11,88.27 117.47,88.9 v111.12,88.9 | v111.12,74.93 U$3.106 | R10.1 86.05,34.6 86.36,34.29 U$3.65 | SSA2:IC2.4 19.68,49.85 SSA2:C2.- 20.32,48.26 | SSA3:IC2.4 SSA3:C2.- 19.05,26.67 19.68,26.04 24.13,26.04 26.04,27.94 v26.67,27.94 | SSA4:IC2.4 SSA4:C2.- 19.05,5.08 19.68,4.45 25.4,4.45 26.67,5.71 v27.94,5.71 31.75,5.71 32.38,6.35 32.38,13.34 28.57,17.14 28.57,23.72 27.94,24.36 26.67,24.36 v26.67,24.18 26.21,23.72 11.2,23.72 9.53,25.4 9.53,27.62 8.73,28.41 8.73,33.18 7.62,34.29 SSA3:R3.1 SSA3:C17.2 | SSA1:C17.2 SSA1:R3.1 8.26,73.03 8.89,72.39 9.08,72.39 10.16,71.31 10.16,67.31 10.92,66.55 28.7,66.55 29.21,66.04 29.21,62.23 33.02,58.42 v33.02,48.26 33.02,47.62 31.11,47.62 | SSA2:C17.2 11.21,55.88 SSA2:R3.1 8.26,50.8 9.84,49.21 9.84,45.4 10.16,45.09 29.84,45.09 v31.11,43.81 | SSA4:C3.2 24.13,19.05 22.86,17.78 21.59,17.78 | SSA4:IC2.1 21.59,17.78 | SSA4:IC2.4 20.32,10.16 20.95,10.79 20.95,17.14 21.59,17.78
  Bottom 0.61: SSA3:C3.2 24.13,40.64 22.86,39.37 21.59,39.37 | 21.59,39.37 SSA3:IC2.1 19.05,40.64 18.41,41.27 v16.82,41.27 | SSA3:IC2.4 20.32,31.75 20.95,32.38 20.95,38.73 21.59,39.37 | SSA2:IC2.1 22.23,60.96 | 22.23,60.96 24.13,62.87 SSA2:C3.2 | SSA2:IC2.4 20.95,53.34 22.23,54.61 22.23,60.96 | SSA1:IC2.1 22.23,83.19 | 22.23,83.19 23.5,83.19 24.77,84.45 SSA1:C3.2 | SSA1:IC2.4 SSA1:C2.- 19.68,69.53 20.2,69.02 31.75,69.02 32.38,69.66 32.38,73.66 33.02,74.3 33.02,77.91 29.21,81.72 v29.21,85.72 | SSA1:IC2.4 20.95,75.56 21.59,76.2 21.59,82.55 22.23,83.19 | SSA1:IC2.4 13.34,75.56 12.7,74.93 SSA1:Q4.S | SSA2:IC2.4 13.34,53.34 12.7,52.7 SSA2:Q4.S | SSA3:Q4.S 12.06,31.11 12.7,31.75 SSA3:IC2.4 | 105.41,67.94 105.41,66.67 U$3.100 | U$3.26 v38.1,48.26 | 31.11,47.62 20.95,47.62 20.32,48.26 | SL3.3 SL3.2 SL3.1 88.27,6.99 88.27,19.68 87.63,20.32 74.93,20.32 73.66,21.59 U$3.56 | SSA4:C17.2 8.89,13.34 SSA4:R3.1 7.62,6.99 9.53,5.08 9.53,2.54 10.16,1.91 v27.94,1.91 | SSA4:Q4.S 11.43,9.53 12.06,10.16 SSA4:IC2.4 | v31.11,48.26 31.11,47.62 | v16.51,48.26 20.32,48.26 | LED1.K 15.24,98.5 13.97,97.23
N$1  (1 unrouted)
N$2  (1 unrouted)
N$3  (1 unrouted)
N$6
  Bottom 0.61: SSA1:IC2.7 27.94,80.64 31.11,77.47 SSA1:R4.1
N$9
  Bottom 0.61: SSA2:IC2.7 30.48,58.42 31.11,57.78 SSA2:R4.1
N$12
  Bottom 0.61: SSA3:IC2.7 28.57,36.83 29.21,36.2 SSA3:R4.1
N$15
  Bottom 0.61: SSA4:IC2.7 28.57,15.24 29.21,14.61 29.21,13.34 29.84,12.7 SSA4:R4.1
N$16  (1 unrouted)
N$17  (1 unrouted)
N$18  (1 unrouted)
N$19  (2 unrouted)
N$20  (1 unrouted)
N$21  (1 unrouted)
N$22  (1 unrouted)
N$23  (2 unrouted)
N$24
  Bottom 0.61: LED1.A R6.1
N$25
  Bottom 0.61: R8.2 U$3.37
N$26
  Bottom 0.61: R9.2 50.8,21.27 U$3.38
N$27
  Bottom 0.61: R10.2 U$3.39
N$28  (via drill 2.79 pad 3.81)
  other vias: 118.75,104.14
N$29  (via drill 2.79 pad 3.81)
  other vias: 119.38,3.81
N$30  (via drill 2.79 pad 3.81)
  other vias: 3.17,104.14
N$31  (via drill 2.79 pad 3.81)
  other vias: 3.17,3.81
N$32  (2 unrouted)
POT_B  (via drill 0.65 pad 1.52)
  Top 0.61: v40.01,17.78 v52.07,17.78
  Bottom 0.61: SSA3:IC2.3 17.78,33.02 10.79,33.02 10.16,32.38 10.16,28.57 10.79,27.94 10.79,26.04 12.06,24.77 24.77,24.77 26.04,26.04 29.84,26.04 30.48,25.4 30.48,22.86 33.66,19.68 38.1,19.68 v40.01,17.78 | SL3.5 79.38,17.78 v52.07,17.78
POT_G  (via drill 0.65 pad 1.52)
  Top 0.61: v69.85,10.16 v76.83,10.16
  Bottom 0.61: SL3.6 v76.83,10.16 | v69.85,10.16 53.34,10.16 40.32,23.18 35.88,23.18 33.66,25.4 33.66,45.72 33.02,46.35 12.06,46.35 11.43,46.99 11.43,49.49 10.16,50.77 10.16,53.98 10.79,54.61 18.41,54.61 SSA2:IC2.3
POT_I
  Bottom 0.61: SSA4:IC2.3 17.78,11.43 10.16,11.43 9.53,10.79 9.53,6.99 10.79,5.71 10.79,4.45 12.06,3.17 26.67,3.17 27.3,3.81 30.48,3.81 31.11,3.17 81.92,3.17 SL3.4
POT_R
  Bottom 0.61: SSA1:IC2.3 18.41,76.83 10.79,76.83 10.16,76.2 10.16,73.03 11.43,71.75 11.43,68.58 12.06,67.94 33.02,67.94 36.2,64.77 36.2,32.38 38.42,30.16 38.42,28.26 52.07,14.61 74.3,14.61 SL3.7
SSA1:COMP
  Bottom 0.61: SSA1:R5.2 SSA1:IC2.2 | SSA1:Q1.1 17.78,83.19 SSA1:R5.2 | SSA1:R5.2 17.78,79.38 17.14,78.74 SSA1:C17.1
SSA1:N$2
  Bottom 0.61: SSA1:Q1.3 12.7,83.82 12.06,83.19 SSA1:R2.1
SSA1:N$3
  Bottom 0.61: SSA1:Q2.1 3.81,74.3 4.45,74.93 | 4.45,74.93 SSA1:Q2.2 | 4.45,74.93 SSA1:IC1.2
SSA1:N$4
  Bottom 0.61: SSA1:Q1.2 6.99,85.72 6.35,85.09 6.35,76.83 6.99,76.2 6.99,74.3 6.35,73.66 6.35,71.75 | SSA1:IC1.3 6.35,70.48 6.35,71.75 | SSA1:R3.2 6.99,71.12 6.35,71.75
SSA1:N$5
  Bottom 0.61: SSA1:Q4.D SSA1:R5.1
SSA2:COMP
  Bottom 0.61: SSA2:R5.2 SSA2:IC2.2 | SSA2:Q1.1 17.78,60.33 SSA2:R5.2 | SSA2:C17.1 17.14,56.52 17.78,57.15 SSA2:R5.2
SSA2:N$2
  Bottom 0.61: SSA2:Q1.3 12.7,61.59 12.06,60.96 SSA2:R2.1
SSA2:N$3
  Bottom 0.61: SSA2:Q2.1 3.81,52.7 SSA2:Q2.2 5.08,50.8 SSA2:IC1.2
SSA2:N$4
  Bottom 0.61: SSA2:R3.2 SSA2:IC1.3 6.99,49.53 6.99,54.61 6.35,55.24 6.35,57.15 6.99,57.78 6.99,62.23 8.26,63.5 SSA2:Q1.2
SSA2:N$5
  Bottom 0.61: SSA2:Q4.D SSA2:R5.1
SSA3:COMP
  Bottom 0.61: SSA3:R5.2 SSA3:IC2.2 | SSA3:Q1.1 14.61,37.47 15.24,36.83 SSA3:R5.2 | 13.34,34.92 SSA3:C17.1 15.88,34.92 17.14,36.2 SSA3:R5.2
SSA3:N$2
  Bottom 0.61: SSA3:Q1.3 SSA3:R2.1
SSA3:N$3
  Bottom 0.61: SSA3:Q2.2 5.08,31.75 SSA3:Q2.1 3.17,29.84 SSA3:IC1.2
SSA3:N$4
  Bottom 0.61: SSA3:IC1.3 SSA3:R3.2 7.62,32.38 5.71,34.29 5.71,35.56 6.35,36.2 6.35,40.64 6.99,41.27 SSA3:Q1.2
SSA3:N$5
  Bottom 0.61: SSA3:Q4.D SSA3:R5.1
SSA4:COMP
  Bottom 0.61: SSA4:R5.2 17.14,14.61 15.88,13.34 SSA4:C17.1 | SSA4:R5.2 SSA4:IC2.2 | SSA4:Q1.1 17.14,17.78 SSA4:R5.2
SSA4:N$2
  Bottom 0.61: SSA4:Q1.3 SSA4:R2.1
SSA4:N$3
  Bottom 0.61: SSA4:Q2.1 3.17,13.34 SSA4:Q2.2 4.45,12.06 SSA4:IC1.2
SSA4:N$4
  Bottom 0.61: SSA4:Q1.2 6.99,20.32 6.35,19.68 6.35,13.34 5.71,12.7 5.71,9.53 5.08,8.89 SSA4:IC1.3 4.45,7.62 SSA4:R3.2
SSA4:N$5
  Bottom 0.61: SSA4:Q4.D SSA4:R5.1
TCK  (via drill 0.75 pad 1.93)
  Top 0.61: v106.05,80.64 v91.44,80.64
  Bottom 0.61: v91.44,80.64 94.61,80.64 95.25,81.28 U$3.109 | v106.05,80.64 109.86,80.64 111.76,78.74 JTAG1.4
TDI
  Bottom 0.61: JTAG1.8 109.86,83.82 109.22,84.45 109.22,93.98 108.58,94.61 62.23,94.61 61.59,93.98 61.59,92.08 60.96,91.44 41.91,91.44 40.01,89.53 U$3.2
TDO  (via drill 0.75 pad 1.93)
  Top 0.61: v106.05,83.19 100.25,83.19 v100.18,83.26
  Bottom 0.61: v106.05,83.19 107.31,83.19 107.95,82.55 111.12,82.55 112.39,81.28 JTAG1.6 | v100.18,83.26 99.69,82.78 U$3.107
TMS  (via drill 0.75 pad 1.93)
  Top 0.61: v46.35,95.25 v46.35,82.55
  Bottom 0.61: v46.35,82.55 U$3.1 | v46.35,95.25 47.62,96.52 120.65,96.52 121.28,95.89 121.28,68.58 120.65,67.94 116.2,67.94 115.57,68.58 JTAG1.2
(copper drawn outside any net)
  shapes: Bottom area x2